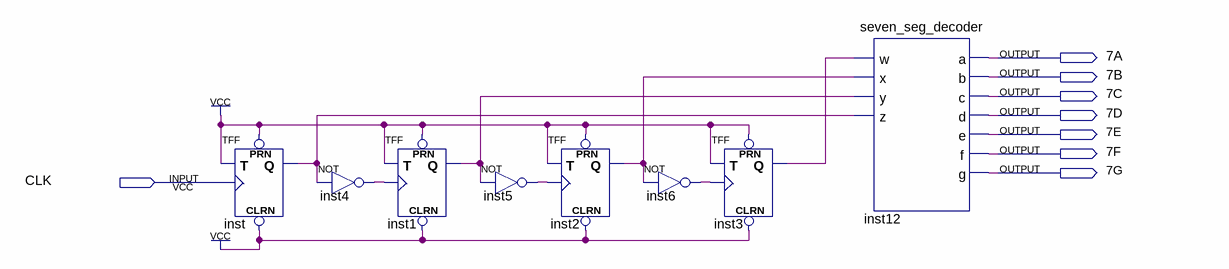
[diagram p0: schematic sheet]
// Quartus schematic LAB10STEP3A.bdf as structural Verilog: 8 symbols, 8 pins
module LAB10STEP3A (
  input  CLK,
  output \7A ,
  output \7B ,
  output \7C ,
  output \7D ,
  output \7E ,
  output \7F ,
  output \7G 
);

  wire inst1_q, inst2_q, inst3_q, inst4_out, inst5_out, inst6_out, inst_q;

  TFF inst (.PRN(1'b1), .CLRN(1'b1), .T(1'b1), .CLK(CLK), .Q(inst_q));
  not inst4 (inst4_out, inst_q);
  TFF inst1 (.PRN(1'b1), .CLRN(1'b1), .T(1'b1), .CLK(inst4_out), .Q(inst1_q));
  not inst5 (inst5_out, inst1_q);
  TFF inst2 (.PRN(1'b1), .CLRN(1'b1), .T(1'b1), .CLK(inst5_out), .Q(inst2_q));
  not inst6 (inst6_out, inst2_q);
  TFF inst3 (.PRN(1'b1), .CLRN(1'b1), .T(1'b1), .CLK(inst6_out), .Q(inst3_q));
  seven_seg_decoder inst12 (
    .w(inst3_q), .x(inst2_q), .y(inst1_q), .z(inst_q), .a(\7A ), .b(\7B ), .c(\7C ), .d(\7D ), .e(\7E ),
    .f(\7F ), .g(\7G ));
endmodule
